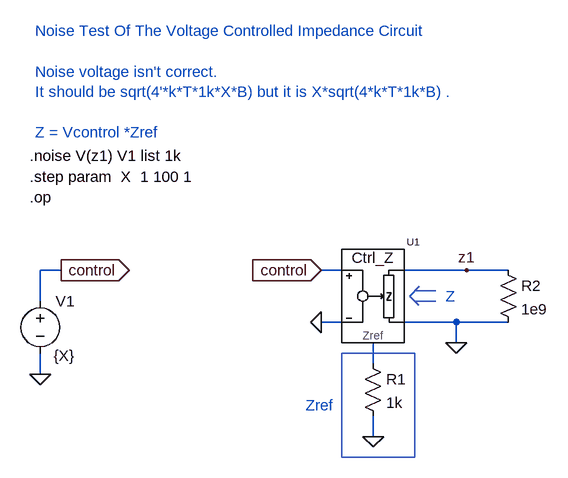
[diagram p0: schematic Ctrl_imp_noise_test.asc]
Ctrl_imp_noise_test.asc, the LTspice schematic file:
Version 4
SHEET 1 1088 680
WIRE 96 32 64 32
WIRE 528 32 496 32
WIRE 720 32 624 32
WIRE 784 32 720 32
WIRE 64 80 64 32
WIRE 528 112 496 112
WIRE 704 112 624 112
WIRE 784 112 704 112
WIRE 704 144 704 112
WIRE 576 176 576 144
WIRE 64 192 64 160
WIRE 576 288 576 256
FLAG 576 288 0
FLAG 496 112 0
FLAG 496 32 control
IOPIN 496 32 In
FLAG 96 32 control
IOPIN 96 32 Out
FLAG 64 192 0
FLAG 720 32 z1
FLAG 704 144 0
SYMBOL voltage 64 64 R0
WINDOW 123 36 114 Left 0
WINDOW 39 0 0 Left 0
WINDOW 3 21 100 Left 0
SYMATTR InstName V1
SYMATTR Value {X}
SYMBOL Ctrl_Z 576 80 R0
SYMATTR InstName U1
SYMBOL res 560 160 R0
SYMATTR InstName R1
SYMATTR Value 1k
SYMBOL res 768 16 R0
SYMATTR InstName R2
SYMATTR Value 1e9
TEXT 56 -336 Left 0 ;Noise Test Of The Voltage Controlled Impedance Circuit\n \nNoise voltage isn't correct.\nIt should be sqrt(4'*k*T*1k*X*B) but it is X*sqrt(4*k*T*1k*B) .\n \nZ = Vcontrol *Zref
TEXT 472 240 Left 0 ;Zref
TEXT 688 72 Left 0 ;Z
TEXT 48 -144 Left 0 !.noise V(z1) V1 list 1k
TEXT 48 -112 Left 0 !.step param  X  1 100 1
TEXT 48 -80 Left 0 !.op
LINE Normal 672 64 640 64
LINE Normal 672 80 640 80
LINE Normal 647 57 632 72
LINE Normal 646 86 632 72
RECTANGLE Normal 640 320 528 160

The netlist it stands for:
* Ctrl_imp_noise_test.asc
V1 control 0 {X}
XU1 control 0 N001 z1 0 Ctrl_Z  ; pins C+ C- Zref Z1 Z2
R1 N001 0 1k
R2 z1 0 1e9
* Noise Test Of The Voltage Controlled Impedance Circuit
* Noise voltage isn't correct.
* It should be sqrt(4'*k*T*1k*X*B) but it is X*sqrt(4*k*T*1k*B) .
* Z = Vcontrol *Zref
* Zref
* Z
.noise V(z1) V1 list 1k
.step param  X  1 100 1
.op
.lib Ctrl_imp_add.sub
.backanno
.end